# EAGLE design cardprog4040 (EAGLE 9.3.1)
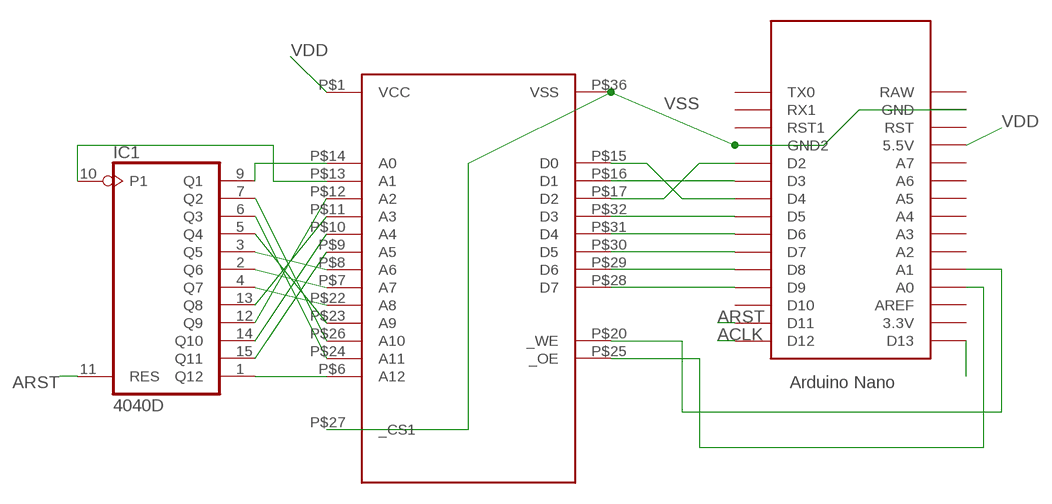
[diagram p0: schematic, sheet 1]

## Parts
IC1  4040D  [SO16]
U$1  NANO  [NANO]
U$2  28C64SLOT  [SLOT36]

## Nets
ACLK: IC1.10(P1) U$1.D12 U$2.P$13(A1)
ARST: IC1.11(RES) U$1.D11
N$1: U$1.A1 U$2.P$20(_WE)
N$2: U$1.D4 U$2.P$15(D0)
N$3: U$1.D3 U$2.P$16(D1)
N$4: U$1.D2 U$2.P$17(D2)
N$5: U$1.D5 U$2.P$32(D3)
N$6: U$1.D6 U$2.P$31(D4)
N$7: U$1.D7 U$2.P$30(D5)
N$8: U$1.D8 U$2.P$29(D6)
N$9: U$1.D9 U$2.P$28(D7)
N$10: U$1.A0 U$2.P$25(_OE)
N$11: IC1.7(Q2) U$2.P$26(A10)
N$12: IC1.6(Q3) U$2.P$24(A11)
N$13: IC1.5(Q4) U$2.P$23(A9)
N$14: IC1.4(Q7) U$2.P$22(A8)
N$15: IC1.3(Q5) U$2.P$8(A6)
N$16: IC1.2(Q6) U$2.P$7(A7)
N$17: IC1.1(Q12) U$2.P$6(A12)
N$18: IC1.15(Q11) U$2.P$9(A5)
N$19: IC1.14(Q10) U$2.P$10(A4)
N$20: IC1.13(Q8) U$2.P$11(A3)
N$21: IC1.12(Q9) U$2.P$12(A2)
N$22: U$1.D13
N$23: IC1.9(Q1) U$2.P$14(A0)
VDD: U$1.5V(5.5V) U$2.P$1(VCC)
VSS: U$1.GND U$1.GND1(GND2) U$2.P$27(_CS1) U$2.P$36(VSS)
Unconnected: U$1.3.3V U$1.A2 U$1.A3 U$1.A4 U$1.A5 U$1.A6 U$1.A7 U$1.AREF U$1.D10 U$1.ICSP1 U$1.ICSP2 U$1.ICSP3 U$1.ICSP4 U$1.ICSP5 U$1.ICSP6 U$1.RAW U$1.RST U$1.RST1 U$1.RX1 U$1.TX0

## Power pins joined to a net without a drawn wire
VDD: IC1.16(VDD)
VSS: IC1.8(VSS)

## Library data of the parts
IC1 = 40xx:4040: 12-stage binary/ripple COUNTER
U$1 = Arduino-clone:NANO: Arduino Nano
U$2 = mychips:28C64

## Board
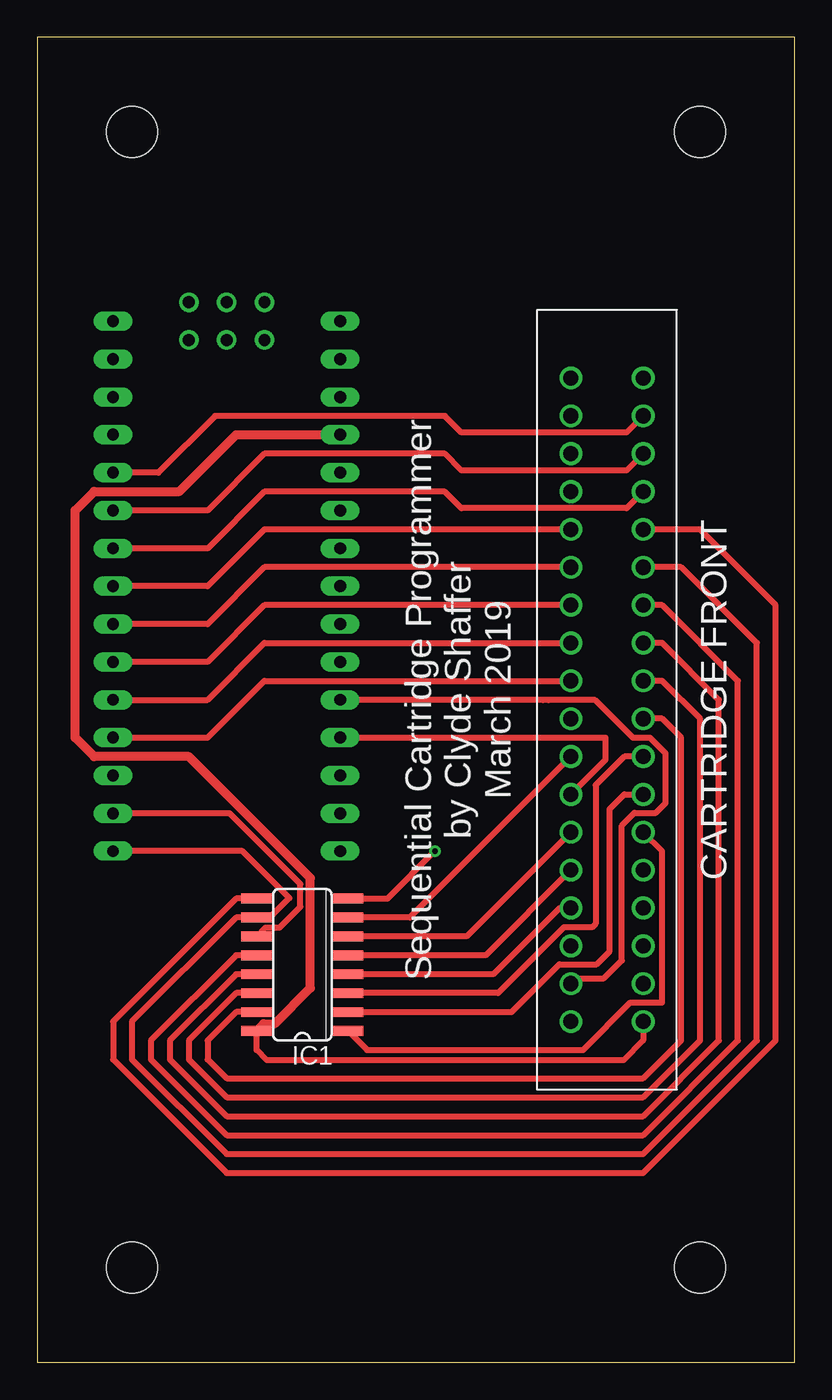
[diagram p1: board, top side]
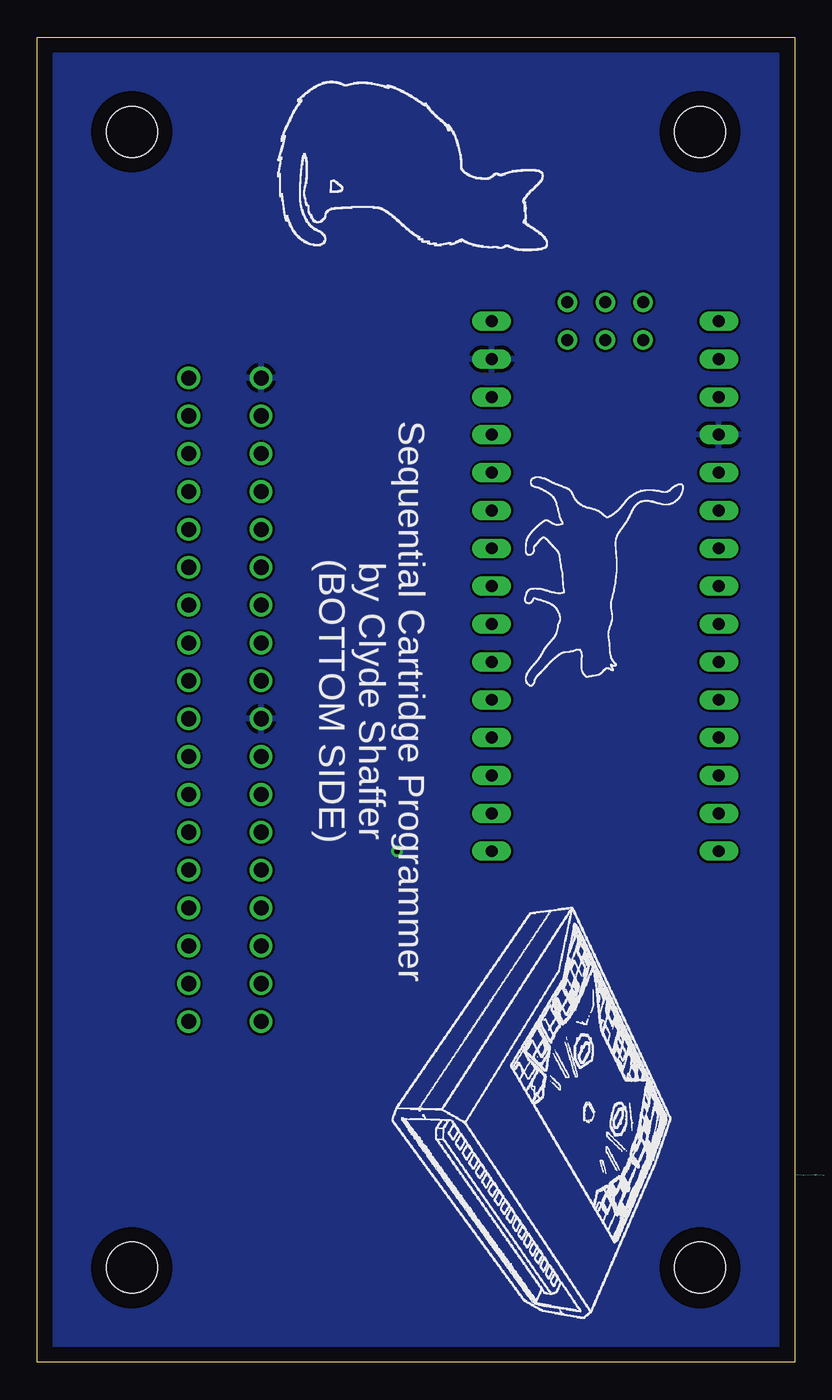
[diagram p2: board, bottom side, seen from below]

Size 50.8 x 88.9 mm. Coordinates in mm from the lower left corner, seen from the top.
Outline: 0,0 50.8,0 50.8,88.9 0,88.9 0,0
Copper layers (1*16): Top 0.035mm / dielectric 1.5mm / Bottom 0.035mm
Design rules "default": minimum track width 6mil, minimum drill 0.35mm, track to track 6mil, track to pad 6mil, pad to pad 6mil, via to via 6mil, smd to smd 6mil, copper to edge 40mil, drill to drill 6mil, minimum pad ring 10mil, minimum via ring 8mil, stop-mask expansion 4mil, vias tented up to drill 0mil, thermal gap 10mil
Holes 3.4 mm at 6.35,82.55 44.45,82.55 6.35,6.35 44.45,6.35

### Footprints (pad centres in the part's own frame; a part is rotated, then mirrored left to right if it is on the bottom)
SO16 = smd 0.66 x 2.032: 1 -4.445,-3.073; 2 -3.175,-3.073; 3 -1.905,-3.073; 4 -0.635,-3.073; 5 0.635,-3.073; 6 1.905,-3.073; 7 3.175,-3.073; 8 4.445,-3.073; 9 4.445,3.073; 10 3.175,3.073; 11 1.905,3.073; 12 0.635,3.073; 13 -0.635,3.073; 14 -1.905,3.073; 15 -3.175,3.073; 16 -4.445,3.073
NANO = drill 0.8 long: 3.3V -10.16,24.13; 5V -10.16,-1.27; A0 -10.16,19.05; A1 -10.16,16.51; A2 -10.16,13.97; A3 -10.16,11.43; A4 -10.16,8.89; A5 -10.16,6.35; A6 -10.16,3.81; A7 -10.16,1.27; AREF -10.16,21.59; D2 5.08,1.27; D3 5.08,3.81; D4 5.08,6.35; D5 5.08,8.89; D6 5.08,11.43; D7 5.08,13.97; D8 5.08,16.51; D9 5.08,19.05; D10 5.08,21.59; D11 5.08,24.13; D12 5.08,26.67; D13 -10.16,26.67; GND -10.16,-6.35; GND1 5.08,-1.27; RAW -10.16,-8.89; RST -10.16,-3.81; RST1 5.08,-3.81; RX1 5.08,-6.35; TX0 5.08,-8.89 | drill 0.8: ICSP1 -5.08,-10.16; ICSP2 -5.08,-7.62; ICSP3 -2.54,-10.16; ICSP4 -2.54,-7.62; ICSP5 0,-10.16; ICSP6 0,-7.62
SLOT36 = drill 1.016 pad 1.524: P$1 -21.59,0; P$2 -19.05,0; P$3 -16.51,0; P$4 -13.97,0; P$5 -11.43,0; P$6 -8.89,0; P$7 -6.35,0; P$8 -3.81,0; P$9 -1.27,0; P$10 1.27,0; P$11 3.81,0; P$12 6.35,0; P$13 8.89,0; P$14 11.43,0; P$15 13.97,0; P$16 16.51,0; P$17 19.05,0; P$18 21.59,0; P$19 -21.59,4.851; P$20 -19.05,4.851; P$21 -16.51,4.851; P$22 -13.97,4.851; P$23 -11.43,4.851; P$24 -8.89,4.851; P$25 -6.35,4.851; P$26 -3.81,4.851; P$27 -1.27,4.851; P$28 1.27,4.851; P$29 3.81,4.851; P$30 6.35,4.851; P$31 8.89,4.851; P$32 11.43,4.851; P$33 13.97,4.851; P$34 16.51,4.851; P$35 19.05,4.851; P$36 21.59,4.851

### Placement (x,y rotation side)
IC1  17.78,26.67 90 top
U$1  10.16,60.96 180 top
U$2  40.64,44.45 90 top

### Tracks (layer width: path | path; a pad name or v marks a point on that pad's centre or on a via)
ACLK
  Top 0.406: U$2.P$13 43.18,53.34 48.26,48.26 48.26,21.59 40.64,13.97 12.7,13.97 6.35,20.32 6.35,22.86 13.34,29.84 IC1.10 15.6,29.84 16.9,31.15 13.76,34.29 U$1.D12
ARST
  Top 0.406: IC1.11 15.29,29.16 16.25,29.16 17.65,30.56 17.65,32.08 12.9,36.83 U$1.D11
N$1
  Top 0.406: U$2.P$20 36.14,25.76 38.01,25.76 39.2,26.95 39.2,36.01 40.05,36.86 41.48,36.86 42.14,37.51 42.14,40.85 41.1,41.88 39.96,41.88 37.42,44.42 34.29,44.42 | 34.29,44.42 33.93,44.42 | 34.29,44.42 34.27,44.45 U$1.A1
N$2
  Top 0.406: U$2.P$15 39.52,57.3 28.45,57.3 27.34,58.41 15.23,58.41 11.43,54.61 U$1.D4
N$3
  Top 0.406: U$2.P$16 39.52,59.84 28.45,59.84 27.34,60.95 15.23,60.95 11.43,57.15 U$1.D3
N$4
  Top 0.406: U$2.P$17 39.52,62.38 28.45,62.38 27.34,63.49 11.93,63.49 8.13,59.69 U$1.D2
N$5
  Top 0.406: U$2.P$32 15.24,55.88 11.43,52.07 U$1.D5
N$6
  Top 0.406: U$2.P$31 15.24,53.34 11.43,49.53 U$1.D6
N$7
  Top 0.406: U$2.P$30 15.24,50.8 11.43,46.99 U$1.D7
N$8
  Top 0.406: U$1.D8 11.43,44.45 15.24,48.26 U$2.P$29
N$9
  Top 0.406: U$1.D9 11.43,41.91 15.24,45.72 U$2.P$28
N$10
  Top 0.406: U$1.A0 38.1,41.91 38.1,40.41 U$2.P$25
N$11
  Top 0.406: U$2.P$26 24.99,29.84 IC1.7
N$12
  Top 0.406: U$2.P$24 28.8,28.57 IC1.6
N$13
  Top 0.406: U$2.P$23 30.07,27.3 IC1.5
N$14
  Top 0.406: U$2.P$22 35.03,30.48 30.58,26.04 IC1.4
N$15
  Top 0.406: U$2.P$8 39.37,40.64 37.45,38.72 37.45,29.42 37.22,29.18 35.33,29.18 30.91,24.77 IC1.3
N$16
  Top 0.406: U$2.P$7 39.37,38.1 38.39,37.12 38.39,27.57 37.52,26.7 35.02,26.7 31.82,23.49 IC1.2
N$17
  Top 0.406: IC1.1 22.12,20.95 36.61,20.95 39.78,24.13 41.91,24.13 41.91,34.29 U$2.P$6
N$18
  Top 0.406: IC1.15 13.34,23.49 11.43,21.59 11.43,20.32 12.7,19.05 40.64,19.05 43.18,21.59 43.18,41.91 41.91,43.18 U$2.P$9
N$19
  Top 0.406: IC1.14 13.34,24.77 10.16,21.59 10.16,20.32 12.7,17.78 40.64,17.78 44.45,21.59 44.45,43.18 41.91,45.72 U$2.P$10
N$20
  Top 0.406: IC1.13 13.34,26.04 8.89,21.59 8.89,20.32 12.7,16.51 40.64,16.51 45.72,21.59 45.72,44.45 41.91,48.26 U$2.P$11
N$21
  Top 0.406: IC1.12 13.34,27.3 7.62,21.59 7.62,20.32 12.7,15.24 40.64,15.24 46.99,21.59 46.99,45.72 41.91,50.8 U$2.P$12
N$23
  Top 0.406: IC1.9 13.34,31.11 5.08,22.86 5.08,20.32 12.7,12.7 40.64,12.7 49.53,21.59 49.53,50.8 44.45,55.88 U$2.P$14
VDD
  Top 0.406: U$2.P$1 40.64,21.59 39.32,20.27 15.39,20.27 14.71,20.95 IC1.16
  Top 0.61: IC1.16 15.19,22.71 15.91,22.71 18.31,25.11 18.31,32.49 10.16,40.64 3.81,40.64 2.54,41.91 2.54,57.15 3.81,58.42 9.53,58.42 13.34,62.23 U$1.5V
VSS  (via drill 0.35)
  Top 0.406: IC1.8 23.5,31.11 v26.67,34.29
  pour Bottom: -1.96,90.41 -1.84,-2.41 52.77,-2.41 52.65,90.21

### Text on the board
tPlace: Sequential Cartridge Programmer / by Clyde Shaffer / March 2019 | CARTRIDGE FRONT
bPlace: Sequential Cartridge Programmer / by Clyde Shaffer / (BOTTOM SIDE) | C:/Users/clyde/Pictures/BW/cat3.bmp